# Altium schematic sheet ESP32-S3.SchDoc
size A3; SheetNumber: 3; SheetTotal: 9
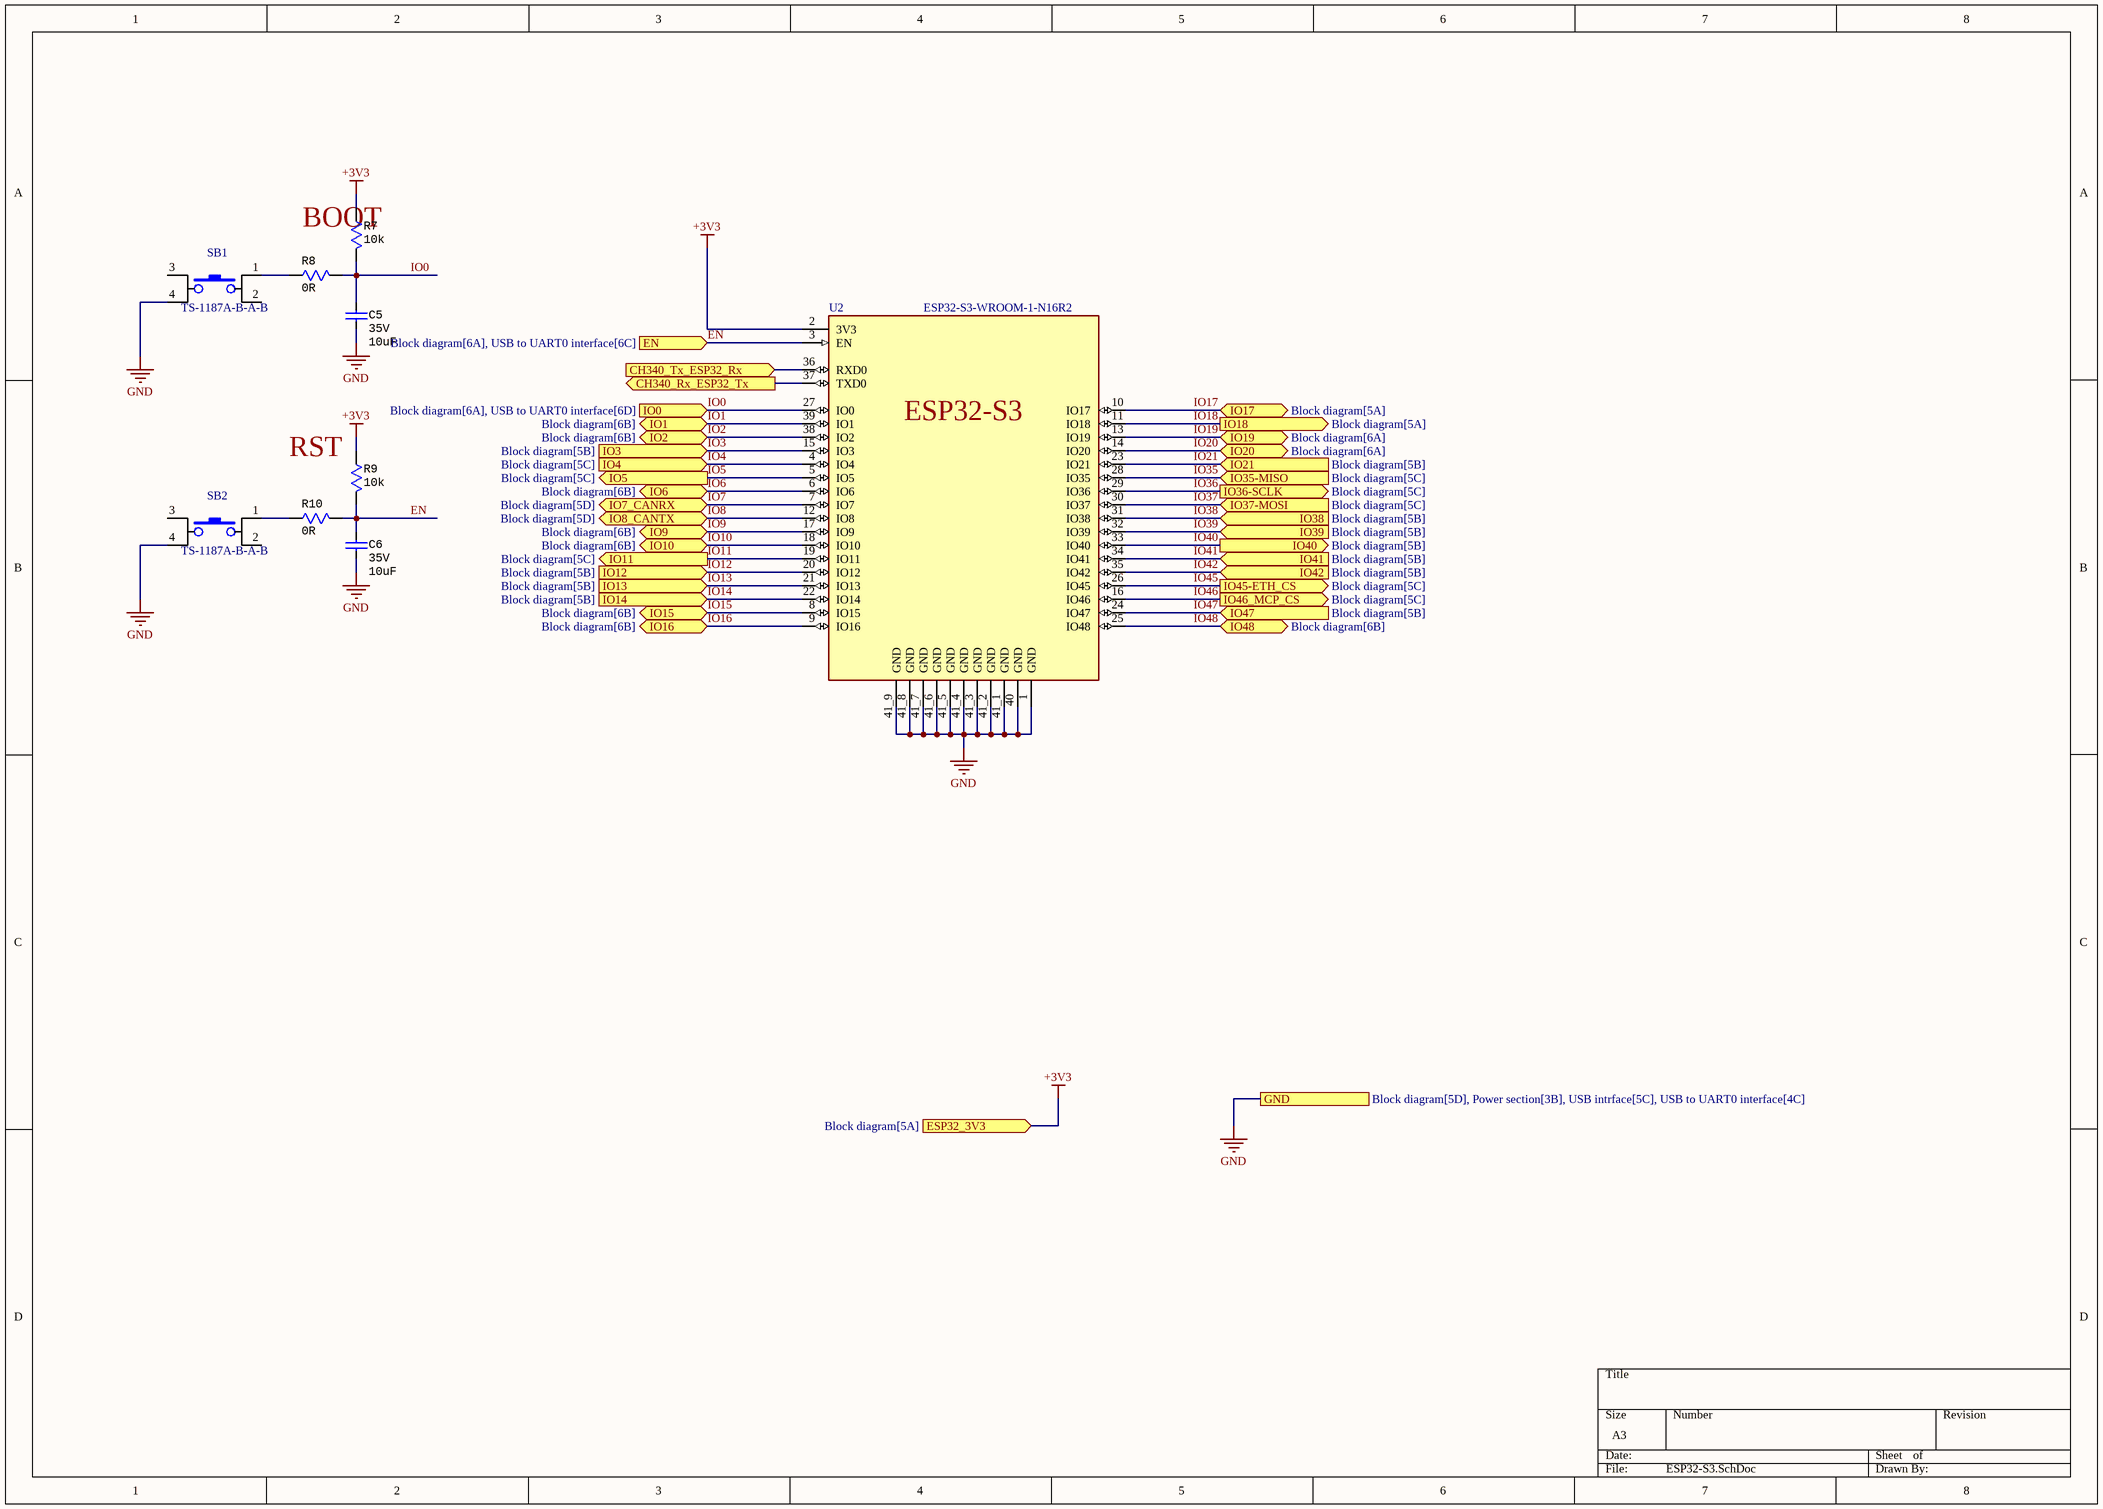
[diagram p0: ESP32-S3.SchDoc]

## Parts
C5  Voltage: 35V  [CAP Ceramic SMD 0603]  (hidden comment: 10uF)
C6  Voltage: 35V  [CAP Ceramic SMD 0603]  (hidden comment: 10uF)
R7  value 10k  [RES SMD 0603]  (hidden comment: 10kR)
R8  0R  [RES SMD 0603]
R9  value 10k  [RES SMD 0603]  (hidden comment: 10kR)
R10  0R  [RES SMD 0603]
SB1  TS-1187A-B-A-B  [SW-SMD-4X4X1.5]
SB2  TS-1187A-B-A-B  [SW-SMD-4X4X1.5]
U2  ESP32-S3-WROOM-1-N16R2  [ESP32-S3-WROOM-1-N16R2]

## Ports
CH340_Rx_ESP32_Tx (out, see Block diagram[6A], USB to UART0 interface[4B]), CH340_Tx_ESP32_Rx (in, see Block diagram[6A], USB to UART0 interface[4B]), EN (in, see Block diagram[6A], USB to UART0 interface[6C]), ESP32_3V3 (in, see Block diagram[5A]), GND (see Block diagram[5D], Power section[3B], USB intrface[5C], USB to UART0 interface[4C]), IO0 (in, see Block diagram[6A], USB to UART0 interface[6D]), IO1 (bidir, see Block diagram[6B]), IO2 (bidir, see Block diagram[6B]), IO3 (in, see Block diagram[5B]), IO4 (in, see Block diagram[5C]), IO5 (out, see Block diagram[5C]), IO6 (bidir, see Block diagram[6B]), IO7_CANRX (bidir, see Block diagram[5D]), IO8_CANTX (bidir, see Block diagram[5D]), IO9 (bidir, see Block diagram[6B]), IO10 (bidir, see Block diagram[6B]), IO11 (out, see Block diagram[5C]), IO12 (in, see Block diagram[5B]), IO13 (in, see Block diagram[5B]), IO14 (in, see Block diagram[5B]), IO15 (bidir, see Block diagram[6B]), IO16 (bidir, see Block diagram[6B]), IO17 (bidir, see Block diagram[5A]), IO18 (out, see Block diagram[5A]), IO19 (bidir, see Block diagram[6A]), IO20 (bidir, see Block diagram[6A]), IO21 (in, see Block diagram[5B]), IO35-MISO (in, see Block diagram[5C]), IO36-SCLK (out, see Block diagram[5C]), IO37-MOSI (in, see Block diagram[5C]), IO38 (in, see Block diagram[5B]), IO39 (in, see Block diagram[5B]), IO40 (out, see Block diagram[5B]), IO41 (in, see Block diagram[5B]), IO42 (in, see Block diagram[5B]), IO45-ETH_CS (out, see Block diagram[5C]), IO46_MCP_CS (out, see Block diagram[5C]), IO47 (in, see Block diagram[5B]), IO48 (bidir, see Block diagram[6B])

## Nets
+3V3: R7.2 R9.2 U2.2(3V3) ; port ESP32_3V3
GND: C5.1 C6.1 SB1.4 SB2.4 U2.1(GND) U2.40(GND) U2.41_1(GND) U2.41_2(GND) U2.41_3(GND) U2.41_4(GND) U2.41_5(GND) U2.41_6(GND) U2.41_7(GND) U2.41_8(GND) U2.41_9(GND) ; port GND
CH340_Rx_ESP32_Tx: U2.37(TXD0) ; port CH340_Rx_ESP32_Tx
CH340_Tx_ESP32_Rx: U2.36(RXD0) ; port CH340_Tx_ESP32_Rx
EN: C6.2 R9.1 R10.1 U2.3(EN) ; port EN
IO0: C5.2 R7.1 R8.1 U2.27(IO0) ; port IO0
IO1: U2.39(IO1) ; port IO1
IO2: U2.38(IO2) ; port IO2
IO3: U2.15(IO3) ; port IO3
IO4: U2.4(IO4) ; port IO4
IO5: U2.5(IO5) ; port IO5
IO6: U2.6(IO6) ; port IO6
IO7: U2.7(IO7) ; port IO7_CANRX
IO8: U2.12(IO8) ; port IO8_CANTX
IO9: U2.17(IO9) ; port IO9
IO10: U2.18(IO10) ; port IO10
IO11: U2.19(IO11) ; port IO11
IO12: U2.20(IO12) ; port IO12
IO13: U2.21(IO13) ; port IO13
IO14: U2.22(IO14) ; port IO14
IO15: U2.8(IO15) ; port IO15
IO16: U2.9(IO16) ; port IO16
IO17: U2.10(IO17) ; port IO17
IO18: U2.11(IO18) ; port IO18
IO19: U2.13(IO19) ; port IO19
IO20: U2.14(IO20) ; port IO20
IO21: U2.23(IO21) ; port IO21
IO35: U2.28(IO35) ; port IO35-MISO
IO36: U2.29(IO36) ; port IO36-SCLK
IO37: U2.30(IO37) ; port IO37-MOSI
IO38: U2.31(IO38) ; port IO38
IO39: U2.32(IO39) ; port IO39
IO40: U2.33(IO40) ; port IO40
IO41: U2.34(IO41) ; port IO41
IO42: U2.35(IO42) ; port IO42
IO45: U2.26(IO45) ; port IO45-ETH_CS
IO46: U2.16(IO46) ; port IO46_MCP_CS
IO47: U2.24(IO47) ; port IO47
IO48: U2.25(IO48) ; port IO48
NetR8_2: R8.2 SB1.1
NetR10_2: R10.2 SB2.1

Not connected (* = marked no-connect by the designer): SB1 2 3; SB2 2 3

## Notes on the sheet
- BOOT
- RST
- (in symbol ESP32-S3-WROOM-1-N16R2) ESP32-S3

## Library data of the parts
C5 C6 = CAP 0603 10uF 35V: Cap Ceramic 10uF 35V X5R 20% Pad SMD 0603 85C T/R; Manufacturer: Murata; Manufacturer Part Number: GRM188R6YA106MA73D; Supplier 1: LCSC; RoHS: Yes; Category: Ceramic Capacitors; Mount: Surface Mount; Case/Package: 0603; Case Code (Metric): 1608; Case Code (Imperial): 0603; Min Operating Temperature: -55°C; Max Operating Temperature: 85°C; Packaging: Tape and Reel; Capacitance: 10uF; Voltage Rating: 35V; Tolerance: 20%; Dielectric: X5R; Voltage Rating (DC): 35V; Length: 0.063inch; Width: 0.031inch; Thickness: 0.039inch; RoHS Compliant: Yes; ComponentLink1URL: http://search.murata.co.jp/Ceramy/image/img/A01X/G101/ENG/GRM188R6YA106MA73-01.pdf?src-supplier=Future+Electronics; ComponentLink1Description: http://search.murata.co.jp/Ceramy/image/img/A01X/G101/ENG/GRM188R6YA106MA73-01.pdf?src-supplier=Future+Electronics; ComponentLink2URL: http://search.murata.co.jp/Ceramy/image/img/A01X/G101/ENG/GRM188R6YA106MA73-01.pdf?src-supplier=Digi-Key; ComponentLink2Description: http://search.murata.co.jp/Ceramy/image/img/A01X/G101/ENG/GRM188R6YA106MA73-01.pdf?src-supplier=Digi-Key; ComponentLink3URL: https://www.murata.com/~/media/webrenewal/support/library/catalog/products/capacitor/mlcc/c02e.ashx?la=en-us&src-supplier=Digi-Key; ComponentLink3Description: https://www.murata.com/~/media/webrenewal/support/library/catalog/products/capacitor/mlcc/c02e.ashx?la=en-us&src-supplier=Digi-Key; ComponentLink4URL: http://search.murata.co.jp/Ceramy/image/img/A01X/G101/ENG/GRM188R6YA106MA73-01.pdf?src-supplier=Mouser; ComponentLink4Description: http://search.murata.co.jp/Ceramy/image/img/A01X/G101/ENG/GRM188R6YA106MA73-01.pdf?src-supplier=Mouser; ComponentLink5URL: http://search.murata.co.jp/Ceramy/image/img/A01X/G101/ENG/GRM188R6YA106MA73-01.pdf?src-supplier=TTI; ComponentLink5Description: http://search.murata.co.jp/Ceramy/image/img/A01X/G101/ENG/GRM188R6YA106MA73-01.pdf?src-supplier=TTI; Supplier Part Number 1: C194427; Value: 10uF
R7 R9 = RES 0603 10k 1%: Res Thick Film 0603 10K Ohm 1% 1/10W ±100ppm/°C Molded SMD Punched Carrier T/R; Manufacturer: Panasonic; Manufacturer Part Number: ERJ-3EKF1002V; Max Power Dissipation: 100mW; Voltage Rating: 75V; Supplier 1: LCSC; RoHS: Yes; Category: Chip SMD Resistors; Stock 1: 555600; Pricing 1: 50=0.010200, 500=0.008400, 1500=0.007300, 5000=0.006100, 25000=0.005500, 50000=0.005400 (AUD); Mount: Surface Mount; Case/Package: 0603; Number of Pins: 2; Case Code (Metric): 1608; Case Code (Imperial): 0603; Contact Plating: Tin; Size Code: 0603; Min Operating Temperature: -55°C; Max Operating Temperature: 155°C; Resistance: 10kR; Packaging: Tape and Reel; Resistor Type: Thick Film; Temperature Coefficient: 100ppm/°C; Tolerance: 1%; Number of Terminations: 2; Series: ERJ; Construction: Rectangular; Power Rating: 100mW; Features: Automotive AEC-Q200; Voltage Rating (DC): 75V; Package Quantity: 1; Resistance Tolerance: 1%; Termination: SMD/SMT; Technology: THICK FILM; Length: 1.6mm; Width: 0.031inch; Height: 0.45mm; Depth: 0.8mm; Radiation Hardening: No; RoHS Compliant: Yes; Military Standard: Not; Lead Free: Lead Free; REACH SVHC: No SVHC; ComponentLink1URL: https://datasheet.ciiva.com/7830/aoa0000ce2-7830729.pdf?src-supplier=Element14; ComponentLink1Description: https://datasheet.ciiva.com/7830/aoa0000ce2-7830729.pdf?src-supplier=Element14; ComponentLink2URL: https://datasheet.ciiva.com/46372/1678782-46372725.pdf?src-supplier=Element14; ComponentLink2Description: https://datasheet.ciiva.com/46372/1678782-46372725.pdf?src-supplier=Element14; ComponentLink3URL: https://datasheet.ciiva.com/28514/426256-28514198.pdf?src-supplier=Element14; ComponentLink3Description: https://datasheet.ciiva.com/28514/426256-28514198.pdf?src-supplier=Element14; ComponentLink4URL: https://datasheet.ciiva.com/24070/aoa0000ce2-24070318.pdf?src-supplier=Mouser; ComponentLink4Description: https://datasheet.ciiva.com/24070/aoa0000ce2-24070318.pdf?src-supplier=Mouser; ComponentLink5URL: https://datasheet.ciiva.com/16759/70260748-16759807.pdf?src-supplier=Allied+Electronics; ComponentLink5Description: https://datasheet.ciiva.com/16759/70260748-16759807.pdf?src-supplier=Allied+Electronics; ComponentLink6URL: https://datasheet.ciiva.com/9194/aoa0000ce2-9194199.pdf?src-supplier=Avnet; ComponentLink6Description: https://datasheet.ciiva.com/9194/aoa0000ce2-9194199.pdf?src-supplier=Avnet; ComponentLink7URL: https://datasheet.ciiva.com/48530/aoa0000ce2-48530988.pdf?src-supplier=Avnet; ComponentLink7Description: https://datasheet.ciiva.com/48530/aoa0000ce2-48530988.pdf?src-supplier=Avnet; ComponentLink8URL: https://datasheet.ciiva.com/30208/aoa0000ce2-30208985.pdf?src-supplier=Onlinecomponents.com; ComponentLink8Description: https://datasheet.ciiva.com/30208/aoa0000ce2-30208985.pdf?src-supplier=Onlinecomponents.com; Supplier Part Number 1: C191124
R8 R10 = RES 0603 0R 1%: ERJ Series 0603 0 Ohm 0.05 W Jumper Surface Mount Thick Film Chip Resistor; Manufacturer: Panasonic; Manufacturer Part Number: ERJ-3GEY0R00V; Tolerance: 1%; Max Power Dissipation: 100mW; Voltage Rating (DC): 50V; Temperature Coefficient: 600ppm/°C; Voltage Rating: 75V; Supplier 1: Arrow Electronics; RoHS: Yes; Category: Chip SMD Resistors; Stock 1: 3440000; Pricing 1: 5000=0.00480 (USD); Mount: Surface Mount; Case/Package: 0603; Case Code (Metric): 1608; Case Code (Imperial): 0603; Contact Plating: Tin; Size Code: 0603; Min Operating Temperature: -55°C; Max Operating Temperature: 155°C; Packaging: Tape and Reel; Resistance: 0R; Resistor Type: Thick Film; Number of Terminations: 2; Series: ERJ; Power Rating: 100mW; Package Quantity: 1; Construction: Rectangular; Termination: SMD/SMT; Features: Automotive AEC-Q200; Technology: THICK FILM; Length: 1.6mm; Width: 0.031inch; Height: 0.45mm; Depth: 0.8mm; Radiation Hardening: No; RoHS Compliant: Yes; Lead Free: Lead Free; Military Standard: Not; REACH SVHC: No SVHC; ComponentLink1URL: https://datasheet.ciiva.com/27055/1935748-27055113.pdf?src-supplier=Jameco; ComponentLink1Description: https://datasheet.ciiva.com/27055/1935748-27055113.pdf?src-supplier=Jameco; ComponentLink2URL: https://datasheet.ciiva.com/11808/0900766b80f806dd-11808207.pdf?src-supplier=RSComponents; ComponentLink2Description: https://datasheet.ciiva.com/11808/0900766b80f806dd-11808207.pdf?src-supplier=RSComponents; ComponentLink3URL: https://datasheet.ciiva.com/48532/aoa0000ce1-48532165.pdf?src-supplier=Avnet; ComponentLink3Description: https://datasheet.ciiva.com/48532/aoa0000ce1-48532165.pdf?src-supplier=Avnet; ComponentLink4URL: https://datasheet.ciiva.com/43460/1678796-43460647.pdf?src-supplier=Farnell; ComponentLink4Description: https://datasheet.ciiva.com/43460/1678796-43460647.pdf?src-supplier=Farnell; ComponentLink5URL: https://datasheet.ciiva.com/28695/1678796-28695833.pdf?src-supplier=Element14; ComponentLink5Description: https://datasheet.ciiva.com/28695/1678796-28695833.pdf?src-supplier=Element14; ComponentLink6URL: https://datasheet.ciiva.com/5959/1678796-5959707.pdf?src-supplier=Farnell; ComponentLink6Description: https://datasheet.ciiva.com/5959/1678796-5959707.pdf?src-supplier=Farnell; ComponentLink7URL: https://datasheet.ciiva.com/16834/aoa0000ce1-16834828.pdf?src-supplier=Future+Electronics; ComponentLink7Description: https://datasheet.ciiva.com/16834/aoa0000ce1-16834828.pdf?src-supplier=Future+Electronics; ComponentLink8URL: https://datasheet.ciiva.com/46377/1678796-46377868.pdf?src-supplier=Element14; ComponentLink8Description: https://datasheet.ciiva.com/46377/1678796-46377868.pdf?src-supplier=Element14; ComponentLink9URL: https://datasheet.ciiva.com/30199/4aoa0000ce1-30199822.pdf?src-supplier=Onlinecomponents.com; ComponentLink9Description: https://datasheet.ciiva.com/30199/4aoa0000ce1-30199822.pdf?src-supplier=Onlinecomponents.com; ComponentLink10URL: https://datasheet.ciiva.com/9198/aoa0000ce1-9198975.pdf?src-supplier=Avnet; ComponentLink10Description: https://datasheet.ciiva.com/9198/aoa0000ce1-9198975.pdf?src-supplier=Avnet; ComponentLink11URL: https://datasheet.ciiva.com/16758/70255313-16758527.pdf?src-supplier=Allied+Electronics; ComponentLink11Description: https://datasheet.ciiva.com/16758/70255313-16758527.pdf?src-supplier=Allied+Electronics; Supplier Part Number 1: ERJ-3GEY0R00V; Supplier 2: LCSC; Stock 2: 79900; Pricing 2: 50=0.00820, 500=0.00670, 1500=0.00590, 5000=0.00540, 25000=0.00500, 50000=0.00480 (USD); ComponentLink12URL: https://datasheet.ciiva.com/22730/1678796-22730749.pdf?src-supplier=Element14; ComponentLink12Description: https://datasheet.ciiva.com/22730/1678796-22730749.pdf?src-supplier=Element14; Supplier Part Number 2: C716999; Value: 0R
U2 = ESP32-S3-WROOM-1-N16R2: WiFi-Modul 802.11/BT 2, 4-2, 5GHz 150Mb/s; Manufacturer: Espressif Systems; Supplier 1: LCSC; Manufacturer Part Number: ESP32-S3-WROOM-1-N16R2; RoHS: No; Category: Uncategorized; Stock 1: 710; Pricing 1: 1=4.10300, 10=4.10300, 30=4.00600, 32=4.00600, 34=4.00600, 36=4.00600 (USD); Supplier Part Number 1: C2913205
SB1 SB2 = TS-1187A-B-A-B: Manufacturer: *; Part Number: *; Supplier: *; Supplier part number: *; Supplier 1: LCSC; Supplier Part Number 1: C318884; Manufacturer Part Number: TS-1187A-B-A-B; RoHS: No; Category: Uncategorized; Stock 1: 372850; Pricing 1: 50=0.01550, 500=0.01200, 1500=0.01040, 4000=0.00920, 24000=0.00870, 48000=0.00840 (USD)